# Altium schematic sheet WS2818B.SchDoc
size A4; SheetNumber: 3; SheetTotal: 4
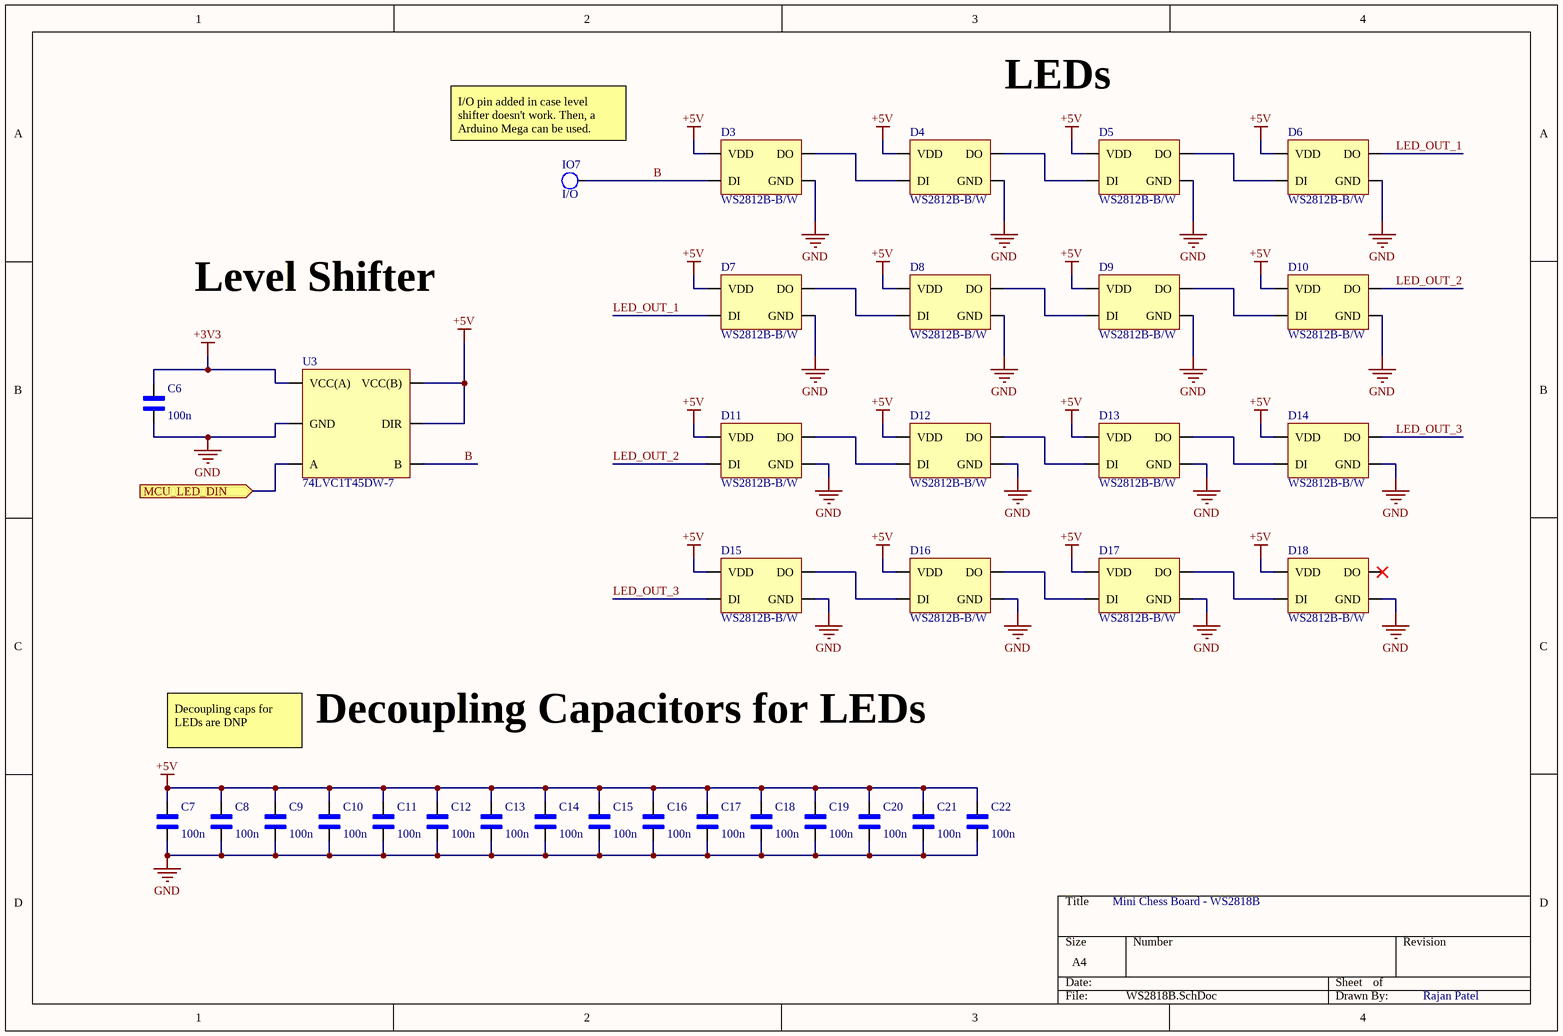
[diagram p0: WS2818B.SchDoc]

## Parts
C6  100n  [CAP 0805]
C7  100n  [CAP 0805]
C8  100n  [CAP 0805]
C9  100n  [CAP 0805]
C10  100n  [CAP 0805]
C11  100n  [CAP 0805]
C12  100n  [CAP 0805]
C13  100n  [CAP 0805]
C14  100n  [CAP 0805]
C15  100n  [CAP 0805]
C16  100n  [CAP 0805]
C17  100n  [CAP 0805]
C18  100n  [CAP 0805]
C19  100n  [CAP 0805]
C20  100n  [CAP 0805]
C21  100n  [CAP 0805]
C22  100n  [CAP 0805]
D3  WS2812B-B/W  [WS2812B-B/W]
D4  WS2812B-B/W  [WS2812B-B/W]
D5  WS2812B-B/W  [WS2812B-B/W]
D6  WS2812B-B/W  [WS2812B-B/W]
D7  WS2812B-B/W  [WS2812B-B/W]
D8  WS2812B-B/W  [WS2812B-B/W]
D9  WS2812B-B/W  [WS2812B-B/W]
D10  WS2812B-B/W  [WS2812B-B/W]
D11  WS2812B-B/W  [WS2812B-B/W]
D12  WS2812B-B/W  [WS2812B-B/W]
D13  WS2812B-B/W  [WS2812B-B/W]
D14  WS2812B-B/W  [WS2812B-B/W]
D15  WS2812B-B/W  [WS2812B-B/W]
D16  WS2812B-B/W  [WS2812B-B/W]
D17  WS2812B-B/W  [WS2812B-B/W]
D18  WS2812B-B/W  [WS2812B-B/W]
IO7  I/O  [I/O]
U3  74LVC1T45DW-7  [74LVC1T45DW-7]

## Ports
MCU_LED_DIN (in, see MCU and Power Man[2C])

## Nets
+3V3: C6.2 U3.1(VCC(A))
+5V: C7.2 C8.2 C9.2 C10.2 C11.2 C12.2 C13.2 C14.2 C15.2 C16.2 C17.2 C18.2 C19.2 C20.2 C21.2 C22.2 D3.1(VDD) D4.1(VDD) D5.1(VDD) D6.1(VDD) D7.1(VDD) D8.1(VDD) D9.1(VDD) D10.1(VDD) D11.1(VDD) D12.1(VDD) D13.1(VDD) D14.1(VDD) D15.1(VDD) D16.1(VDD) D17.1(VDD) D18.1(VDD) U3.5(DIR) U3.6(VCC(B))
GND: C6.1 C7.1 C8.1 C9.1 C10.1 C11.1 C12.1 C13.1 C14.1 C15.1 C16.1 C17.1 C18.1 C19.1 C20.1 C21.1 C22.1 D3.4(GND) D4.4(GND) D5.4(GND) D6.4(GND) D7.4(GND) D8.4(GND) D9.4(GND) D10.4(GND) D11.4(GND) D12.4(GND) D13.4(GND) D14.4(GND) D15.4(GND) D16.4(GND) D17.4(GND) D18.4(GND) U3.2(GND)
B: D3.2(DI) IO7.1 U3.4(B)
LED_OUT_1: D6.3(DO) D7.2(DI)
LED_OUT_2: D10.3(DO) D11.2(DI)
LED_OUT_3: D14.3(DO) D15.2(DI)
MCU_LED_DIN: U3.3(A) ; port MCU_LED_DIN
NetD3_3: D3.3(DO) D4.2(DI)
NetD4_3: D4.3(DO) D5.2(DI)
NetD5_3: D5.3(DO) D6.2(DI)
NetD7_3: D7.3(DO) D8.2(DI)
NetD8_3: D8.3(DO) D9.2(DI)
NetD9_3: D9.3(DO) D10.2(DI)
NetD11_3: D11.3(DO) D12.2(DI)
NetD12_3: D12.3(DO) D13.2(DI)
NetD13_3: D13.3(DO) D14.2(DI)
NetD15_3: D15.3(DO) D16.2(DI)
NetD16_3: D16.3(DO) D17.2(DI)
NetD17_3: D17.3(DO) D18.2(DI)

Not connected (* = marked no-connect by the designer): D18 3(DO)*

## Notes on the sheet
- LEDs
- (near IO7) I/O pin added in case level shifter doesn't work. Then, a Arduino Mega can be used.
- Level Shifter
- Decoupling caps for LEDs are DNP
- Decoupling Capacitors for LEDs
- Mini Chess Board - WS2818B
- Rajan Patel

## Library data of the parts
C6-C22 = CAP 0805: SnapEDA_Link: https://www.snapeda.com/parts/C2012X8R1H104K125AA/TDK/view-part/?ref=snap; Check_prices: https://www.snapeda.com/parts/C2012X8R1H104K125AA/TDK/view-part/?ref=eda; Value: *
D3-D18 = WS2812B-B/W: SMD5050 RGB LEDs(Built-in IC) ROHS; Manufacturer: Worldsemi; Supplier: LCSC; Supplier Part Number: C114586; Manufacturer Part Number: WS2812B-B/W
U3 = 74LVC1T45DW-7: Bus Transceiver, LVC/LCX/Z Series, 1-Func, 1-Bit, True Output, CMOS, PDSO6; Manufacturer: Diodes; Package Body Material: Plastic; Control Type: COMMON CONTROL; Count Direction: Bidirectional; Load/Preset Input: Yes; Max I(ol): 24mA; Number of Bits: 1; Number of Ports: 2; Output Characteristics: 3-STATE; Package Equivalence Code: TSSOP6,.08; Power Supplies: 3.3V; Max Supply Voltage: 5.5V; Min Supply Voltage: 1.65V; Qualification Status: Not Qualified; Supplier: Future Electronics; Supplier Part Number: 3070442; Manufacturer Part Number: 74LVC1T45DW-7; RoHS: Yes; Stock: 42000; Pricing: 3000=0.0512, 9000=0.0494, 15000=0.0485, 60000=0.0463, 90000=0.0449 (USD); Case/Package: TSSOP; Pins: 6; Package Shape: Rectangular; Terminal Finish: Tin; Min Operating Temperature: -40°C; Max Operating Temperature: 125°C; JESD-609 Code: e3; Output Polarity: True; JESD-30 Code: R-PDSO-G6; Logic Type: BUS TRANSCEIVER; Moisture Sensitivity Level: 1; Channels: 1; Package Style: SMALL OUTLINE, THIN PROFILE, SHRINK PITCHMeter; Packaging: Tape and Reel; Nominal Supply Voltage: 3.3V; Surface Mount: Yes; Technology: CMOS; Terminal Form: Gull Wing; Terminal Position: DUAL; Length: 2mm; Width: 1.25mm; Height - Seated (Max): 1.1mm; Terminal Pitch: 0.65mm; Temperature Grade: AUTOMOTIVE; Reach SVHC Compliant: Yes; RoHS Compliant: Yes; ComponentLink1URL: https://datasheet.ciiva.com:443/pdfs/VipMasterIC/IC/DIOD/DIOD-S-A0006644025/DIOD-S-A0006644025-1.pdf?src-supplier=IHS+Markit; ComponentLink1Description: https://datasheet.ciiva.com:443/pdfs/VipMasterIC/IC/DIOD/DIOD-S-A0006644025/DIOD-S-A0006644025-1.pdf?src-supplier=IHS+Markit; ComponentLink2URL: http://www.mouser.com/ds/2/115/74LVC1T45-318124.pdf?src-supplier=Mouser; ComponentLink2Description: http://www.mouser.com/ds/2/115/74LVC1T45-318124.pdf?src-supplier=Mouser; ComponentLink3URL: https://www.diodes.com/assets/Datasheets/74LVC1T45.pdf?src-supplier=Digikey; ComponentLink3Description: https://www.diodes.com/assets/Datasheets/74LVC1T45.pdf?src-supplier=Digikey; ComponentLink4URL: https://datasheet.octopart.com/74LVC1T45DW-7-Diodes-Inc.-datasheet-160640065.pdf?src-supplier=Newark; ComponentLink4Description: https://datasheet.octopart.com/74LVC1T45DW-7-Diodes-Inc.-datasheet-160640065.pdf?src-supplier=Newark; ComponentLink5URL: http://www.diodes.com/datasheets/74LVC1T45.pdf?src-supplier=Avnet; ComponentLink5Description: http://www.diodes.com/datasheets/74LVC1T45.pdf?src-supplier=Avnet